# EAGLE schematic FNR Controller v1.1 - Relay (EAGLE 6.3)
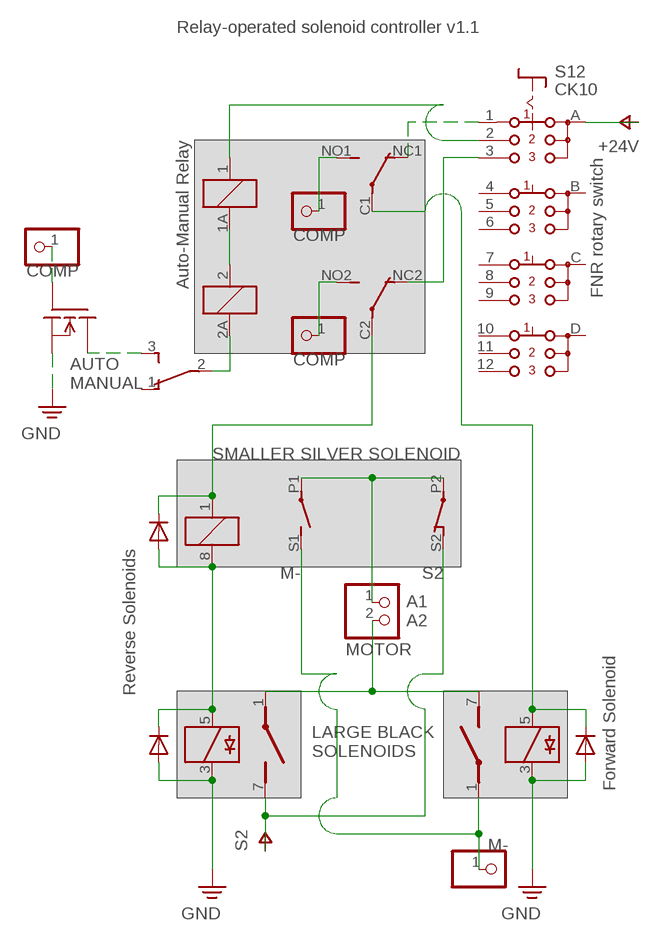
[diagram p0: schematic, sheet 1]

## Parts
D4  1N4004  [DO41-10]
D5  1N4004  [DO41-10]
D6  1N4004  [DO41-10]
JP12  COMP  PINHD-1X1  [1X01]
JP18  MOTOR  PINHD-1X2  [1X02]
JP19  M-  PINHD-1X1  [1X01]
JP20  COMP  PINHD-1X1  [1X01]
JP21  COMP  PINHD-1X1  [1X01]
K11  CT512  [CT2-TWIN]
K12  35701331  [REED]
K13  35701331  [REED]
K14  G6C-2117P  [G6C-2117P]
Q3  BUZ11  [TO220]
S11  M-A  TL36PO  [TL3XPO]
S12  CK10  [CK10]

## Nets
M-: JP19.1 K13.1(2:P) K14.S1(2:S)
N$69: JP18.2 K12.1(2:P) K13.7(2:S)
N$70: D5.C K11.C2(B1:P) K14.1
N$71: K11.1A K11.2
N$72: K11.2A S11.2(P)
N$73: JP12.1 K11.NO1(A1:S)
N$74: JP20.1 K11.NO2(B1:S)
N$75: K11.1 S12.2(A2)
N$76: D4.C D5.A K12.5 K14.8
N$77: JP18.1 K14.P1(2:P) K14.P2(3:P)
N$78: Q3.2(D) S11.3(S)
N$79: JP21.1 Q3.1(G)
N$80: K11.NC1(A1:O) S12.1(A1)
N$81: K11.NC2(B1:O) S12.3(A3)
N$82: D6.C K11.C1(A1:P) K13.5
PE: D4.A D6.A K12.3 K13.3 Q3.3(S) ; supply symbol labelled GND
S2: K12.7(2:S) K14.S2(3:O) S12.A ; supply symbol labelled +24V
Unconnected: S11.1(O) S12.4(B1) S12.5(B2) S12.6(B3) S12.7(C1) S12.8(C2) S12.9(C3) S12.10(D1) S12.11(D2) S12.12(D3) S12.B S12.C S12.D

## Notes on the sheet
- Relay-operated solenoid controller v1.1
- Auto-Manual Relay
- FNR rotary switch
- AUTO
  MANUAL
- SMALLER SILVER SOLENOID
- Reverse Solenoids
- A1
  A2
- Forward Solenoid
- LARGE BLACK
  SOLENOIDS

## Library data of the parts
D4-D6 = adafruit:1N4004: DIODE General purpose 1N400x type rectifier (With bigger pads) http://www.ladyada.net/library/pcb/eaglelibrary.html
JP12 JP19-JP21 = adafruit:PINHD-1X1: Pin header 1x1 for 0.1" spacing With round pins
JP18 = pinhead:PINHD-1X2: PIN HEADER
K11 = relay:CT512: ULTRA SMALL AUTOMOTIVE RELAY NAiS Twin type (10 terminals) en_ds_61205_0000.pdf; OC_FARNELL: unknown; OC_NEWARK: unknown
K12 K13 = relay:35701331: RELAY reed, 1 x norm. open with polarity; OC_FARNELL: unknown; OC_NEWARK: unknown
K14 = relay:G6C-2117P: RELAY 1 x norm. open, 1x norm. closed, 10 A/240 V, Omron; OC_FARNELL: unknown; OC_NEWARK: unknown
Q3 = transistor-fet:BUZ11: N-Channel Enhancement MOSFET 50V; 30A; 0,040Ohm
S11 = switch:TL36PO: TINY SWITCH ON - ON Source: http://www2.produktinfo.conrad.com/datenblaetter/700000-724999/705152-da-01-de-Subminiaturschalter_TL_36YO.pdf
S12 = switch:CK10: ROTARY SWITCH C&K